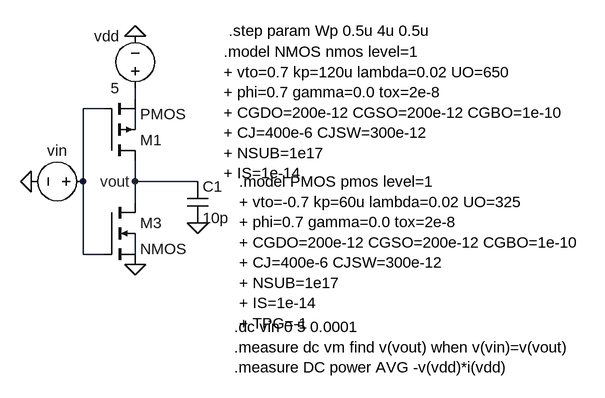
[diagram p0: schematic Draft6.asc]
Draft6.asc, the LTspice schematic file:
Version 4.1
SHEET 1 940 680
WIRE 208 64 208 48
WIRE 160 80 128 80
WIRE 208 112 208 80
WIRE 128 192 128 80
WIRE 208 192 208 160
WIRE 304 192 208 192
WIRE 208 224 208 192
WIRE 128 304 128 192
WIRE 160 304 128 304
WIRE 208 304 208 272
FLAG 208 320 0
FLAG 304 256 0
FLAG 208 -32 0
FLAG 48 192 0
FLAG 208 192 vout
SYMBOL voltage 208 64 R180
WINDOW 0 24 96 Left 2
WINDOW 3 24 16 Left 2
WINDOW 123 0 0 Left 0
WINDOW 39 0 0 Left 0
SYMATTR InstName vdd
SYMATTR Value 5
SYMBOL voltage 144 192 R90
WINDOW 0 -32 56 VBottom 2
WINDOW 3 32 56 VTop 2
SYMATTR InstName vin
SYMATTR Value ""
SYMBOL cap 288 192 R0
SYMATTR InstName C1
SYMATTR Value 10p
SYMBOL nmos4 160 224 R0
SYMATTR InstName M3
SYMATTR Value2 l=1u w=1u
SYMBOL pmos4 160 160 M180
SYMATTR InstName M1
SYMATTR Value2 l=1u w={Wp}
TEXT 344 -8 Left 2 !.model NMOS nmos level=1\n+ vto=0.7 kp=120u lambda=0.02 UO=650\n+ phi=0.7 gamma=0.0 tox=2e-8\n+ CGDO=200e-12 CGSO=200e-12 CGBO=1e-10\n+ CJ=400e-6 CJSW=300e-12\n+ NSUB=1e17\n+ IS=1e-14
TEXT 368 192 Left 2 !.model PMOS pmos level=1\n+ vto=-0.7 kp=60u lambda=0.02 UO=325\n+ phi=0.7 gamma=0.0 tox=2e-8\n+ CGDO=200e-12 CGSO=200e-12 CGBO=1e-10\n+ CJ=400e-6 CJSW=300e-12\n+ NSUB=1e17\n+ IS=1e-14\n+ TPG=-1
TEXT 352 -40 Left 2 !.step param Wp 0.5u 4u 0.5u
TEXT 360 416 Left 2 !.dc vin 0 5 0.0001\n.measure dc vm find v(vout) when v(vin)=v(vout)\n.measure DC power AVG -v(vdd)*i(vdd)

The netlist it stands for:
* Draft6.asc
vdd N001 0 5
vin N002 0
C1 vout 0 10p
M3 vout N002 0 N004 NMOS l=1u w=1u
M1 vout N002 N001 N003 PMOS l=1u w={Wp}
.model NMOS NMOS
.model PMOS PMOS
.lib standard.mos
.model NMOS nmos level=1
+ vto=0.7 kp=120u lambda=0.02 UO=650
+ phi=0.7 gamma=0.0 tox=2e-8
+ CGDO=200e-12 CGSO=200e-12 CGBO=1e-10
+ CJ=400e-6 CJSW=300e-12
+ NSUB=1e17
+ IS=1e-14
.model PMOS pmos level=1
+ vto=-0.7 kp=60u lambda=0.02 UO=325
+ phi=0.7 gamma=0.0 tox=2e-8
+ CGDO=200e-12 CGSO=200e-12 CGBO=1e-10
+ CJ=400e-6 CJSW=300e-12
+ NSUB=1e17
+ IS=1e-14
+ TPG=-1
.step param Wp 0.5u 4u 0.5u
.dc vin 0 5 0.0001
.measure dc vm find v(vout) when v(vin)=v(vout)
.measure DC power AVG -v(vdd)*i(vdd)
.backanno
.end